# EAGLE design ILI9341-Touch-connector (EAGLE 6.5.0)
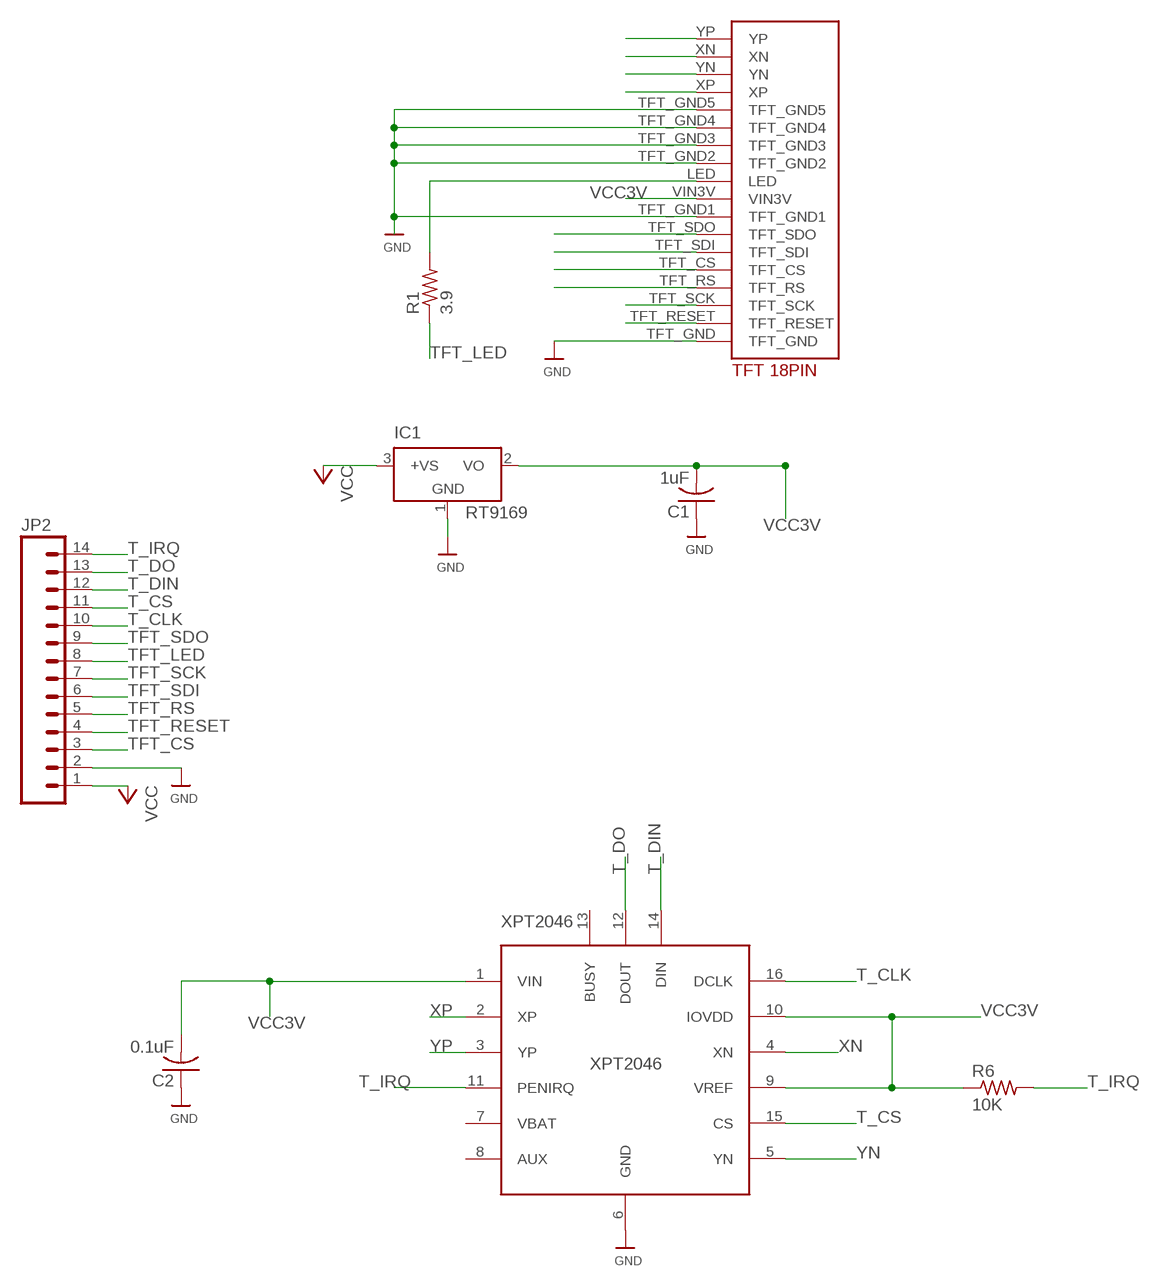
[diagram p0: schematic, sheet 1]

## Parts
C1  1uF  C-USC0805K  [C0805K]
C2  0.1uF  C-USC0805K  [C0805K]
IC1  RT9169  [SOT23]
JP2  M14  [1X14]
R1  3.9  R-US_R0805  [R0805]
R6  10K  R-US_R0805  [R0805]
U$4  TFT_18PIN  [TFT_18PIN]
XPT2046  XPT2046  XPT2046TSSOP16-EXPOSED-PAD-MINIMAL  [TSSOP16-EXPOSED_PAD_MINIMAL]

## Nets
GND: C1.1 C2.1 IC1.1(GND) JP2.2 U$4.TFT_GND U$4.TFT_GND1 U$4.TFT_GND2 U$4.TFT_GND3 U$4.TFT_GND4 U$4.TFT_GND5 XPT2046.6(GND)
N$2: R1.2 U$4.LED
T_CLK: JP2.10 XPT2046.16(DCLK)
T_CS: JP2.11 XPT2046.15(CS)
T_DIN: JP2.12 XPT2046.14(DIN)
T_DO: JP2.13 XPT2046.12(DOUT)
T_IRQ: JP2.14 R6.2 XPT2046.11(PENIRQ)
TFT_CS: JP2.3 U$4.TFT_CS
TFT_LED: JP2.8 R1.1
TFT_RESET: JP2.4 U$4.TFT_RESET
TFT_RS: JP2.5 U$4.TFT_RS
TFT_SCK: JP2.7 U$4.TFT_SCK
TFT_SDI: JP2.6 U$4.TFT_SDI
TFT_SDO: JP2.9 U$4.TFT_SDO
VCC: IC1.3(+VS) JP2.1
VCC3V: C1.2 C2.2 IC1.2(VO) R6.1 U$4.VIN3V XPT2046.1(VIN) XPT2046.9(VREF) XPT2046.10(IOVDD)
XN: U$4.XN XPT2046.4(XN)
XP: U$4.XP XPT2046.2(XP)
YN: U$4.YN XPT2046.5(YN)
YP: U$4.YP XPT2046.3(YP)
Unconnected: XPT2046.7(VBAT) XPT2046.8(AUX) XPT2046.13(BUSY)

## Library data of the parts
C1 C2 = adafruit:C-US: CAPACITOR, American symbol
IC1 = RT9169:RT9169: SOT-23 Voltage regulator
JP2 = SparkFun-Connectors:M14: Header 14 Standard 14-pin 0.1" header. Use with straight break away headers (SKU : PRT-00116), right angle break away headers (PRT-00553), swiss pins (PRT-00743), machine pins (PRT-00117), and female headers (PRT-00115).
R1 R6 = adafruit:R-US_: RESISTOR, American symbol
U$4 = TFT18PIN:TFT_18PIN
XPT2046 = XPT2046-TSSOP-16:XPT2046: Touch Controller

## Board
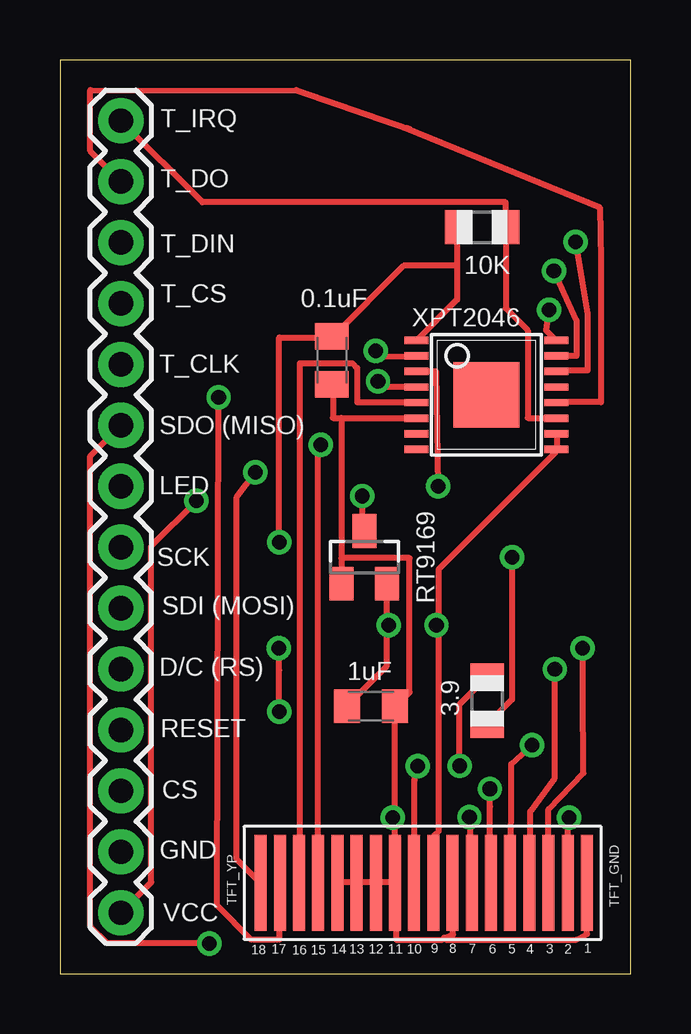
[diagram p1: board, top side]
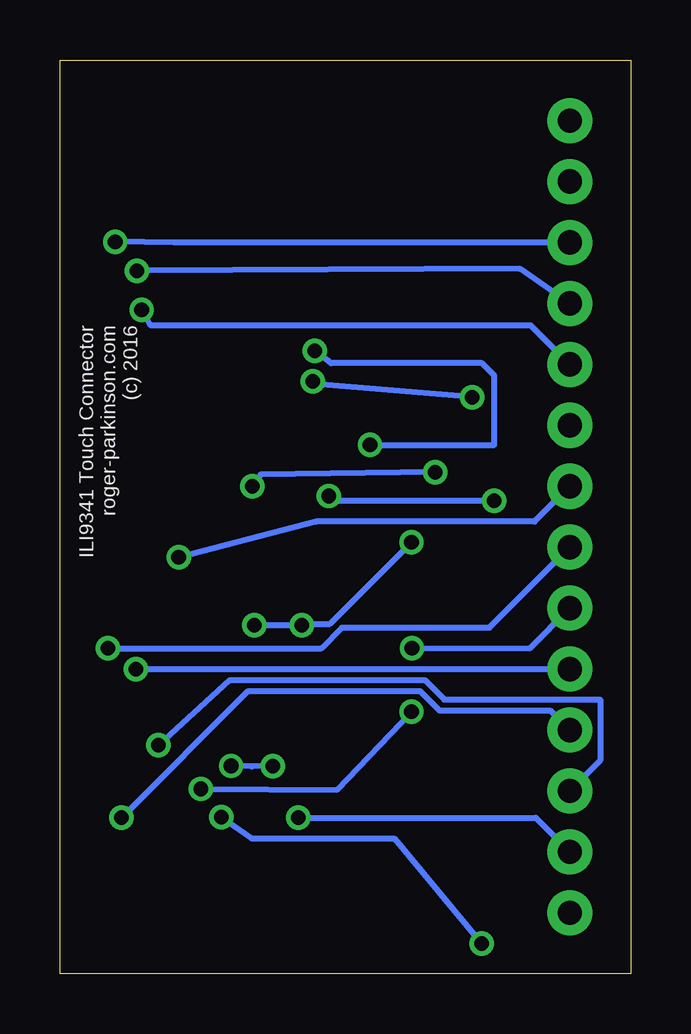
[diagram p2: board, bottom side, seen from below]

Size 23.8 x 38.09 mm. Coordinates in mm from the lower left corner, seen from the top.
Outline: 0,0 23.8,0 23.8,38.09 0,38.09 0,0
Copper layers (1*16): Top 0.035mm / dielectric 1.5mm / Bottom 0.035mm
Design rules "default": minimum track width 10mil, minimum drill 24mil, track to track 8mil, track to pad 8mil, pad to pad 8mil, via to via 8mil, smd to smd 8mil, copper to edge 40mil, drill to drill 8mil, minimum pad ring 10mil, minimum via ring 8mil, stop-mask expansion 4mil, vias tented up to drill 0mil, thermal gap 10mil

### Footprints (pad centres in the part's own frame; a part is rotated, then mirrored left to right if it is on the bottom)
C0805K = smd 1.1 x 1.4: 1 -1,0; 2 1,0
SOT23 = smd 1 x 1.4: 1 -0.95,-1.1; 2 0.95,-1.1; 3 0,1.1
1X14 = drill 1.016 pad 1.88: 1 0,0; 2 2.54,0; 3 5.08,0; 4 7.62,0; 5 10.16,0; 6 12.7,0; 7 15.24,0; 8 17.78,0; 9 20.32,0; 10 22.86,0; 11 25.4,0; 12 27.94,0; 13 30.48,0; 14 33.02,0
R0805 = smd 1.1 x 1.4: 1 -1,0; 2 1,0
TFT_18PIN = smd 0.5 x 4: LED 7.95,2; TFT_CS 3.95,2; TFT_GND 0.75,2; TFT_GND1 6.35,2; TFT_GND2 8.75,2; TFT_GND3 9.55,2; TFT_GND4 10.35,2; TFT_GND5 11.15,2; TFT_RESET 1.55,2; TFT_RS 3.15,2; TFT_SCK 2.35,2; TFT_SDI 4.75,2; TFT_SDO 5.55,2; VIN3V 7.15,2; XN 13.55,2; XP 11.95,2; YN 12.75,2; YP 14.35,2
TSSOP16-EXPOSED_PAD_MINIMAL = smd 0.305 x 0.991: 1 -2.275,-2.918; 2 -1.625,-2.918; 3 -0.975,-2.918; 4 -0.325,-2.918; 5 0.325,-2.918; 6 0.975,-2.918; 7 1.625,-2.918; 8 2.275,-2.918; 9 2.275,2.918; 10 1.625,2.918; 11 0.975,2.918; 12 0.325,2.918; 13 -0.325,2.918; 14 -0.975,2.918; 15 -1.625,2.918; 16 -2.275,2.918 | smd 2.74 x 2.74: GND 0,0

### Placement (x,y rotation side)
C1  12.97,11.15 180 top
C2  11.34,25.56 90 top
IC1  12.69,17.35 0 top
JP2  2.54,2.54 90 top
R1  17.81,11.38 90 top
R6  17.61,31.12 0 top
U$4  22.72,5.78 180 top
XPT2046  17.78,24.13 270 top

### Tracks (layer width: path | path; a pad name or v marks a point on that pad's centre or on a via)
GND  (via drill 0.61)
  Top 0.254: 11.79,16.26 IC1.1 11.73,16.36 11.73,17.32 | 11.73,23.17 11.38,23.17 11.38,24.54 C2.1 | 11.73,23.17 14.83,23.17 XPT2046.6 | 11.73,23.17 11.73,17.32 | U$4.TFT_GND5 11.58,3.81 12.34,3.81 U$4.TFT_GND4 12.5,3.81 13.06,3.81 U$4.TFT_GND3 13.21,3.81 13.87,3.81 U$4.TFT_GND2 | 13.97,6.5 13.97,3.81 U$4.TFT_GND2 | 13.97,6.5 13.97,11.12 C1.1 14.07,11.23 14.58,11.73 14.58,17.32 11.73,17.32 | v13.87,6.5 13.97,6.5 | 16.03,1.5 15.95,1.42 14.02,1.42 14.02,3.66 U$4.TFT_GND2 | 16.03,1.5 16.39,1.63 16.39,3.56 16.36,3.76 U$4.TFT_GND1 | U$4.TFT_GND 21.95,3.76 21.97,3.58 21.97,1.65 21.54,1.42 16.1,1.42 16.03,1.5
  Bottom 0.254: JP2.2 3.96,6.5 v13.87,6.5
N$2  (via drill 0.61)
  Top 0.254: v16.66,8.66 16.66,11.23 17.78,12.34 R1.2 | v14.92,8.66 14.78,8.08 14.78,3.81 U$4.LED
  Bottom 0.254: v16.66,8.66 15.81,8.64 v14.92,8.66
T_CLK  (via drill 0.61)
  Top 0.254: v20.39,27.68 20.27,26.82 20.68,26.42 XPT2046.16
  Bottom 0.254: v20.39,27.68 20.02,27.03 4.17,27.03 JP2.10
T_CS  (via drill 0.61)
  Top 0.254: v20.6,29.3 20.91,28.6 21.54,27.23 21.54,25.76 20.73,25.76 XPT2046.15
  Bottom 0.254: v20.6,29.3 4.63,29.39 JP2.11
T_DIN  (via drill 0.61)
  Top 0.254: v21.5,30.51 22,27.53 22,25.15 20.73,25.15 XPT2046.14
  Bottom 0.254: v21.5,30.51 19.05,30.48 JP2.12
T_DO
  Top 0.254: JP2.13 1.27,34.29 1.27,36.83 9.88,36.82 9.86,36.83 14.58,35.21 14.45,35.25 22.5,31.95 22.55,29.74 22.55,23.82 20.73,23.82 XPT2046.12
T_IRQ
  Top 0.254: XPT2046.11 20.68,23.17 19.51,23.17 19.51,26.82 18.59,27.74 18.59,31.09 R6.2 18.59,31.24 18.59,32.16 5.94,32.16 JP2.14
TFT_CS  (via drill 0.61)
  Top 0.254: v19.69,9.52 18.82,8.73 18.8,3.81 U$4.TFT_CS
  Bottom 0.254: JP2.3 1.27,8.89 1.27,11.43 7.77,11.43 8.59,12.24 16.71,12.24 v19.69,9.52
TFT_LED  (via drill 0.61)
  Top 0.254: v18.85,17.36 18.85,13.11 18.85,11.43 17.83,10.41 R1.1
  Bottom 0.254: v18.85,17.36 13.11,18.85 4.01,18.85 JP2.8
TFT_RESET  (via drill 0.61)
  Top 0.254: v21.23,6.5 21.18,6.45 21.18,3.81 U$4.TFT_RESET
  Bottom 0.254: JP2.4 3.35,10.97 7.98,10.97 8.79,11.79 15.95,11.79 v21.23,6.5
TFT_RS  (via drill 0.61)
  Top 0.254: v20.64,12.7 20.63,10.47 20.64,8.14 19.61,6.76 19.61,3.81 U$4.TFT_RS
  Bottom 0.254: JP2.5 17.78,12.7 v20.64,12.7
TFT_SCK  (via drill 0.61)
  Top 0.254: v21.8,13.56 21.8,11.79 21.82,8.36 20.37,6.86 20.37,3.81 U$4.TFT_SCK
  Bottom 0.254: JP2.7 5.89,14.43 12.04,14.43 12.9,13.56 v21.8,13.56
TFT_SDI  (via drill 0.61)
  Top 0.254: v9.12,13.57 9.14,12.65 v9.14,10.92 | v17.93,7.7 17.93,6.96 17.93,3.81 U$4.TFT_SDI
  Bottom 0.254: JP2.6 4.22,13.56 v9.12,13.57 | v9.14,10.92 12.25,7.67 v17.93,7.7
TFT_SDO  (via drill 0.61)
  Top 0.254: JP2.9 1.27,21.59 1.27,1.98 1.98,1.27 5.07,1.27 v6.22,1.26 | v17.07,6.53 17.12,6.04 17.12,3.81 U$4.TFT_SDO
  Bottom 0.254: v6.22,1.26 9.86,5.64 15.8,5.64 v17.07,6.53
VCC  (via drill 0.61)
  Top 0.254: v12.6,19.91 12.6,18.54 12.65,18.49 IC1.3 | v5.69,19.71 3.81,17.83 3.81,3.81 JP2.1
  Bottom 0.254: v12.6,19.91 12.39,19.71 v5.69,19.71
VCC3V  (via drill 0.61)
  Top 0.254: 16.56,29.51 16.56,31.09 R6.1 | 16.56,29.51 16.56,28.09 14.88,26.42 XPT2046.1 | 16.56,29.51 14.33,29.51 11.38,26.57 C2.2 11.23,26.52 9.14,26.52 v9.14,17.98 | 13.61,14.53 13.61,16.2 IC1.2 | 13.61,14.53 13.61,12.8 11.99,11.18 C1.2 | XPT2046.10 20.73,22.5 20.73,21.89 XPT2046.9 20.68,21.74 15.8,16.87 15.8,14.53 | 15.8,14.53 15.8,5.94 15.6,5.74 15.6,3.81 U$4.VIN3V | v13.72,14.53 13.61,14.53 | v15.7,14.53 15.8,14.53
  Bottom 0.254: v15.7,14.53 v13.72,14.53 13.61,14.58 12.55,14.58 v9.14,17.98
XN  (via drill 0.61)
  Top 0.254: v13.26,24.69 13.26,24.49 14.83,24.49 XPT2046.4 | v6.62,24.03 6.55,2.85 7.98,1.42 9.14,1.42 9.14,3.76 U$4.XN
  Bottom 0.254: v13.26,24.69 13.16,24.59 v6.62,24.03
XP  (via drill 0.61)
  Top 0.254: v13.17,25.97 12.98,25.72 14.83,25.76 XPT2046.2 | v10.87,22.05 10.77,21.95 10.77,3.81 U$4.XP
  Bottom 0.254: v13.17,25.97 12.5,25.45 6.2,25.45 5.69,24.94 5.69,22.05 v10.87,22.05
YN
  Top 0.254: XPT2046.5 14.83,23.82 12.39,23.82 12.39,25.25 12.19,25.45 10.01,25.45 10.01,3.81 U$4.YN
YP  (via drill 0.61)
  Top 0.254: v15.77,20.31 15.7,25.1 14.88,25.1 XPT2046.3 | v8.15,20.91 7.37,19.86 7.37,4.78 8.33,3.81 U$4.YP
  Bottom 0.254: v15.77,20.31 15.44,20.8 v8.15,20.91

### Text on the board
tNames: T_IRQ | T_DO | T_DIN | T_CS | T_CLK | SDO (MISO) | LED | SCK | SDI (MOSI) | D/C (RS) | RESET | CS | GND | TFT_YP | TFT_GND | VCC | 18 | 17 | 16 | 15 | 14 | 13 | 12 | 11 | 10 | 9 | 8 | 7 | 6 | 5 | 4 | 3 | 2 | 1
bNames: ILI9341 Touch Connector / roger-parkinson.com / (c) 2016